# EAGLE design oscillator (EAGLE 6.5.0)
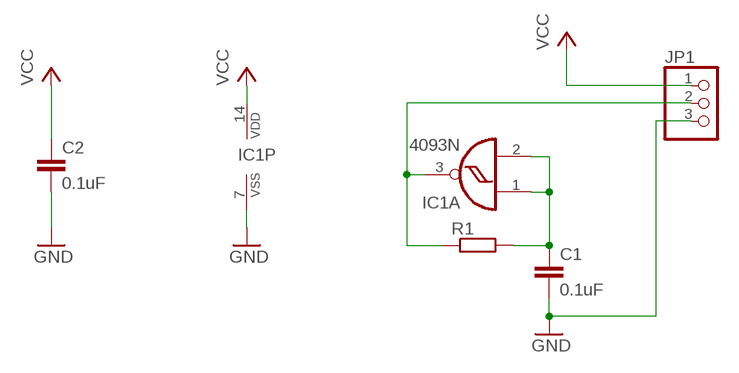
[diagram p0: schematic, sheet 1]

## Parts
C1  0.1uF  C-EU025_050-025X075  [C025_050-025X075]
C2  0.1uF  C-EU025-025X050  [C025-025X050]
IC1  4093N  [DIL14]
JP1  PINHD-1X3  [1X03]
R1  68K  R-EU_0204/7  [0204/7]

## Nets
GND [GND]: C1.2 C2.2 IC1.7(P:VSS) JP1.3
N$15: IC1.3(A:O) JP1.2 R1.1
N$19 [GND]: C1.1 IC1.1(A:I0) IC1.2(A:I1) R1.2
VCC [VCC]: C2.1 IC1.14(P:VDD) JP1.1
Unconnected: IC1.4(B:O) IC1.5(B:I0) IC1.6(B:I1) IC1.8(C:I0) IC1.9(C:I1) IC1.10(C:O) IC1.11(D:O) IC1.12(D:I0) IC1.13(D:I1)

## Library data of the parts
C1 C2 = rcl:C-EU: CAPACITOR, European symbol
IC1 = 40xx:4093: Quad 2-input NAND schmitt trigger
JP1 = pinhead:PINHD-1X3: PIN HEADER
R1 = rcl:R-EU_: RESISTOR, European symbol

## Net classes
0 default: width 0.508 mm, drill 0.508 mm
1 VCC: width 0.508 mm, drill 0.508 mm
2 GND: width 0.508 mm, drill 0.508 mm

## Board
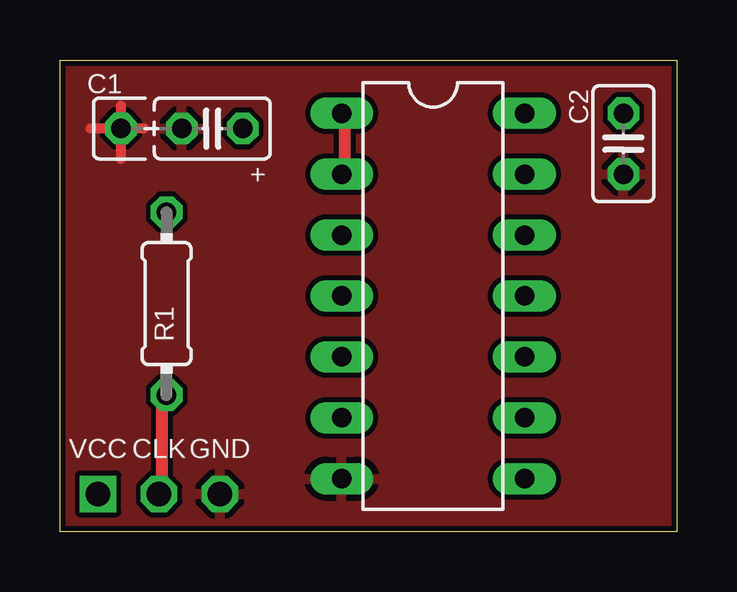
[diagram p1: board, top side]
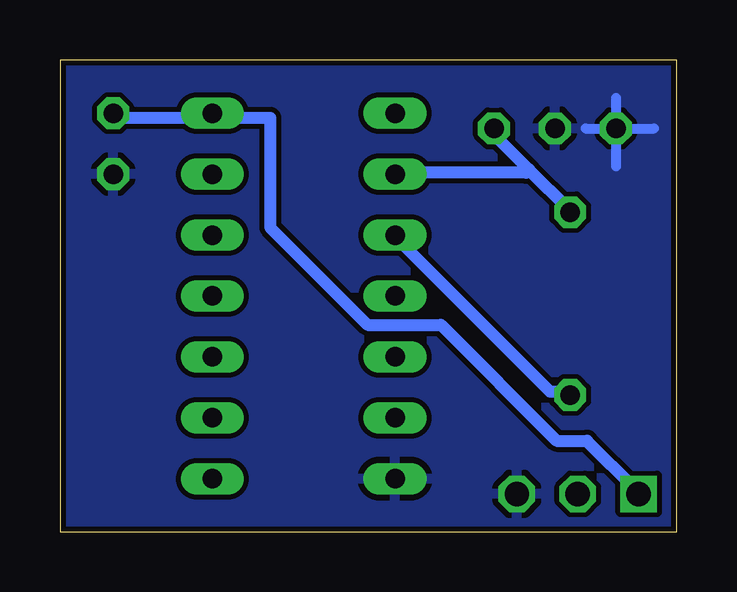
[diagram p2: board, bottom side, seen from below]

Size 25.72 x 19.68 mm. Coordinates in mm from the lower left corner, seen from the top.
Outline: 0,19.68 25.72,19.68 25.72,0 0,0 0,19.68
Copper layers (1*16): Top 0.035mm / dielectric 1.5mm / Bottom 0.035mm
Design rules "default *": minimum track width 10mil, minimum drill 20mil, track to track 8mil, track to pad 8mil, pad to pad 8mil, via to via 8mil, smd to smd 8mil, copper to edge 8mil, drill to drill 8mil, minimum pad ring 10mil, minimum via ring 8mil, stop-mask expansion 4mil, vias tented up to drill 0mil, thermal gap 10mil

### Footprints (pad centres in the part's own frame; a part is rotated, then mirrored left to right if it is on the bottom)
C025_050-025X075 = drill 0.813 octagon: 1 -1.27,0; 2 1.27,0; 3 3.81,0
C025-025X050 = drill 0.813 octagon: 1 -1.27,0; 2 1.27,0
DIL14 = drill 0.813 long: 1 -7.62,-3.81; 2 -5.08,-3.81; 3 -2.54,-3.81; 4 0,-3.81; 5 2.54,-3.81; 6 5.08,-3.81; 7 7.62,-3.81; 8 7.62,3.81; 9 5.08,3.81; 10 2.54,3.81; 11 0,3.81; 12 -2.54,3.81; 13 -5.08,3.81; 14 -7.62,3.81
1X03 = drill 1.016 square: 1 -2.54,0 | drill 1.016 octagon: 2 0,0; 3 2.54,0
0204/7 = drill 0.813 octagon: 1 -3.81,0; 2 3.81,0

### Placement (x,y rotation side)
C1  6.35,16.83 180 top
C2  23.49,16.19 270 top
IC1  15.56,9.84 270 top
JP1  4.13,1.59 0 top
R1  4.44,9.53 90 top

### Tracks (layer width: path | path; a pad name or v marks a point on that pad's centre or on a via)
GND
  Top 0.406: 3.49,16.83 1.27,16.83 | 2.54,17.78 2.54,15.56
  Bottom 0.406: 3.81,16.83 0.95,16.83 | 2.54,18.1 2.54,15.24
  pour Top: -0.64,-0.64 -0.64,20.32 26.35,20.32 26.35,-0.64
  pour Bottom: -0.64,-0.64 -0.64,20.32 26.35,20.32 26.35,-0.64
N$15
  Top 0.508: R1.1 4.25,5.59 4.25,1.78 JP1.2
  Bottom 0.508: IC1.3 11.62,12.19 5.27,5.84 4.51,5.84 R1.1
N$19
  Top 0.508: IC1.2 11.87,14.99 11.87,17.27 IC1.1
  Bottom 0.508: 6.16,15.11 7.81,16.76 C1.1 | 6.16,15.11 4.51,13.46 R1.2 | IC1.2 11.62,14.99 6.29,14.99 6.16,15.11
VCC
  Bottom 0.508: C2.1 23.3,17.27 19.49,17.27 IC1.14 19.24,17.27 16.95,17.27 16.95,12.7 12.89,8.64 9.84,8.64 5.02,3.81 3.75,3.81 1.71,1.78 JP1.1

### Text on the board
tNames: + | VCC | CLK | GND